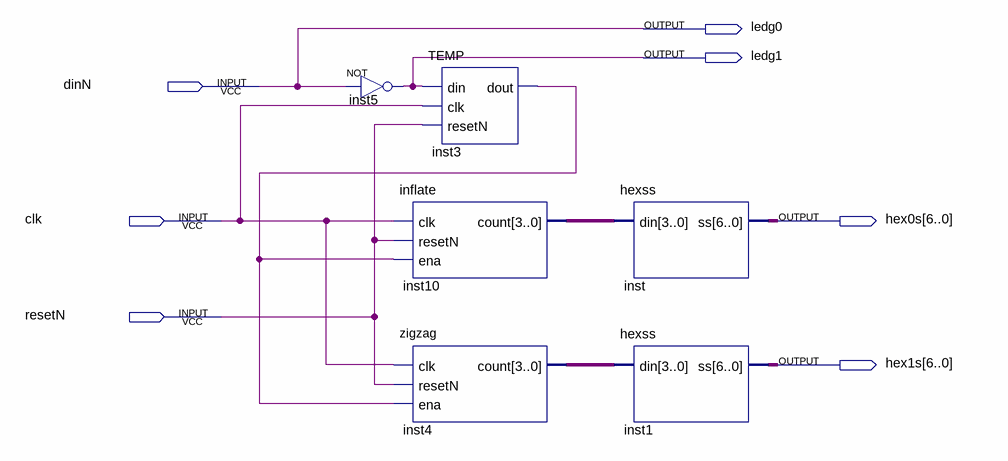
[diagram p0: schematic sheet]
// Quartus schematic test_crazy_counters.bdf as structural Verilog: 6 symbols, 7 pins
module test_crazy_counters (
  input  dinN,
  input  clk,
  input  resetN,
  output ledg0,
  output ledg1,
  output [6:0] hex0s,
  output [6:0] hex1s
);

  wire inst3_dout;
  wire [3:0] inst4_count, inst10_count;

  not inst5 (ledg1, dinN);
  inflate inst10 (.clk(clk), .resetN(resetN), .ena(inst3_dout), .count(inst10_count));
  zigzag inst4 (.clk(clk), .resetN(resetN), .ena(inst3_dout), .count(inst4_count));
  TEMP inst3 (.din(ledg1), .clk(clk), .resetN(resetN), .dout(inst3_dout));
  hexss inst (.din(inst10_count), .ss(hex0s));
  hexss inst1 (.din(inst4_count), .ss(hex1s));

  assign ledg0 = dinN;
endmodule
